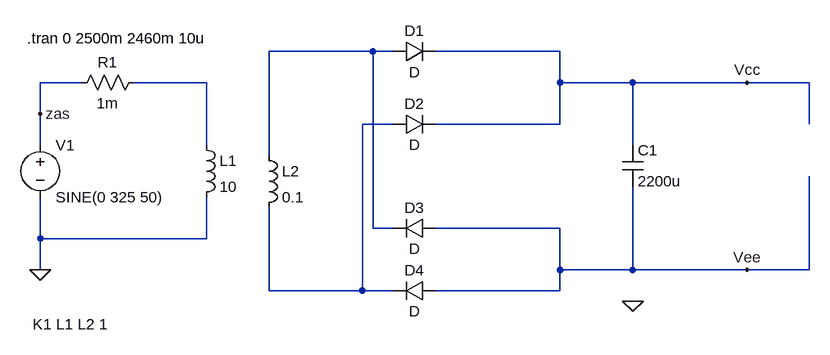
[diagram p0: schematic power_single_noload.asc]
power_single_noload.asc, the LTspice schematic file:
Version 4.1
SHEET 1 1516 1140
WIRE 572 60 412 60
WIRE 604 60 572 60
WIRE 860 60 668 60
WIRE 124 108 60 108
WIRE 316 108 204 108
WIRE 860 108 860 60
WIRE 972 108 860 108
WIRE 1148 108 972 108
WIRE 1244 108 1148 108
WIRE 60 156 60 108
WIRE 604 172 556 172
WIRE 860 172 860 108
WIRE 860 172 668 172
WIRE 1244 172 1244 108
WIRE 60 204 60 156
WIRE 316 204 316 108
WIRE 972 204 972 108
WIRE 412 220 412 60
WIRE 572 332 572 60
WIRE 604 332 572 332
WIRE 860 332 668 332
WIRE 60 348 60 284
WIRE 316 348 316 284
WIRE 316 348 60 348
WIRE 60 396 60 348
WIRE 860 396 860 332
WIRE 972 396 972 268
WIRE 972 396 860 396
WIRE 1148 396 972 396
WIRE 1244 396 1244 252
WIRE 1244 396 1148 396
WIRE 412 428 412 300
WIRE 556 428 556 172
WIRE 556 428 412 428
WIRE 604 428 556 428
WIRE 860 428 860 396
WIRE 860 428 668 428
FLAG 60 396 0
FLAG 972 444 0
FLAG 1148 108 Vcc
FLAG 60 156 zas
FLAG 1148 396 Vee
SYMBOL voltage 60 188 R0
SYMATTR InstName V1
SYMATTR Value SINE(0 325 50)
SYMBOL res 220 92 R90
WINDOW 0 0 56 VBottom 2
WINDOW 3 32 56 VTop 2
SYMATTR InstName R1
SYMATTR Value 1m
SYMBOL ind 300 188 R0
SYMATTR InstName L1
SYMATTR Value 10
SYMATTR Type ind
SYMATTR SpiceLine Rser=1m
SYMBOL ind 396 204 R0
SYMATTR InstName L2
SYMATTR Value 0.1
SYMATTR Type ind
SYMATTR SpiceLine Rser=1m
SYMBOL diode 604 76 R270
WINDOW 0 32 32 VTop 2
WINDOW 3 0 32 VBottom 2
SYMATTR InstName D1
SYMBOL diode 604 188 R270
WINDOW 0 32 32 VTop 2
WINDOW 3 0 32 VBottom 2
SYMATTR InstName D2
SYMBOL diode 668 316 R90
WINDOW 0 0 32 VBottom 2
WINDOW 3 32 32 VTop 2
SYMATTR InstName D3
SYMBOL diode 668 412 R90
WINDOW 0 0 32 VBottom 2
WINDOW 3 32 32 VTop 2
SYMATTR InstName D4
SYMBOL cap 956 204 R0
SYMATTR InstName C1
SYMATTR Value 2200u
TEXT 48 480 Left 2 !K1 L1 L2 1
TEXT 40 40 Left 2 !.tran 0 2500m 2460m 10u

The netlist it stands for:
* power_single_noload.asc
V1 zas 0 SINE(0 325 50)
R1 N002 zas 1m
L1 N002 0 10 Rser=1m
L2 N001 N003 0.1 Rser=1m
D1 N001 Vcc D
D2 N003 Vcc D
D3 Vee N001 D
D4 Vee N003 D
C1 Vcc Vee 2200u
.model D D
.lib standard.dio
K1 L1 L2 1
.tran 0 2500m 2460m 10u
.backanno
.end